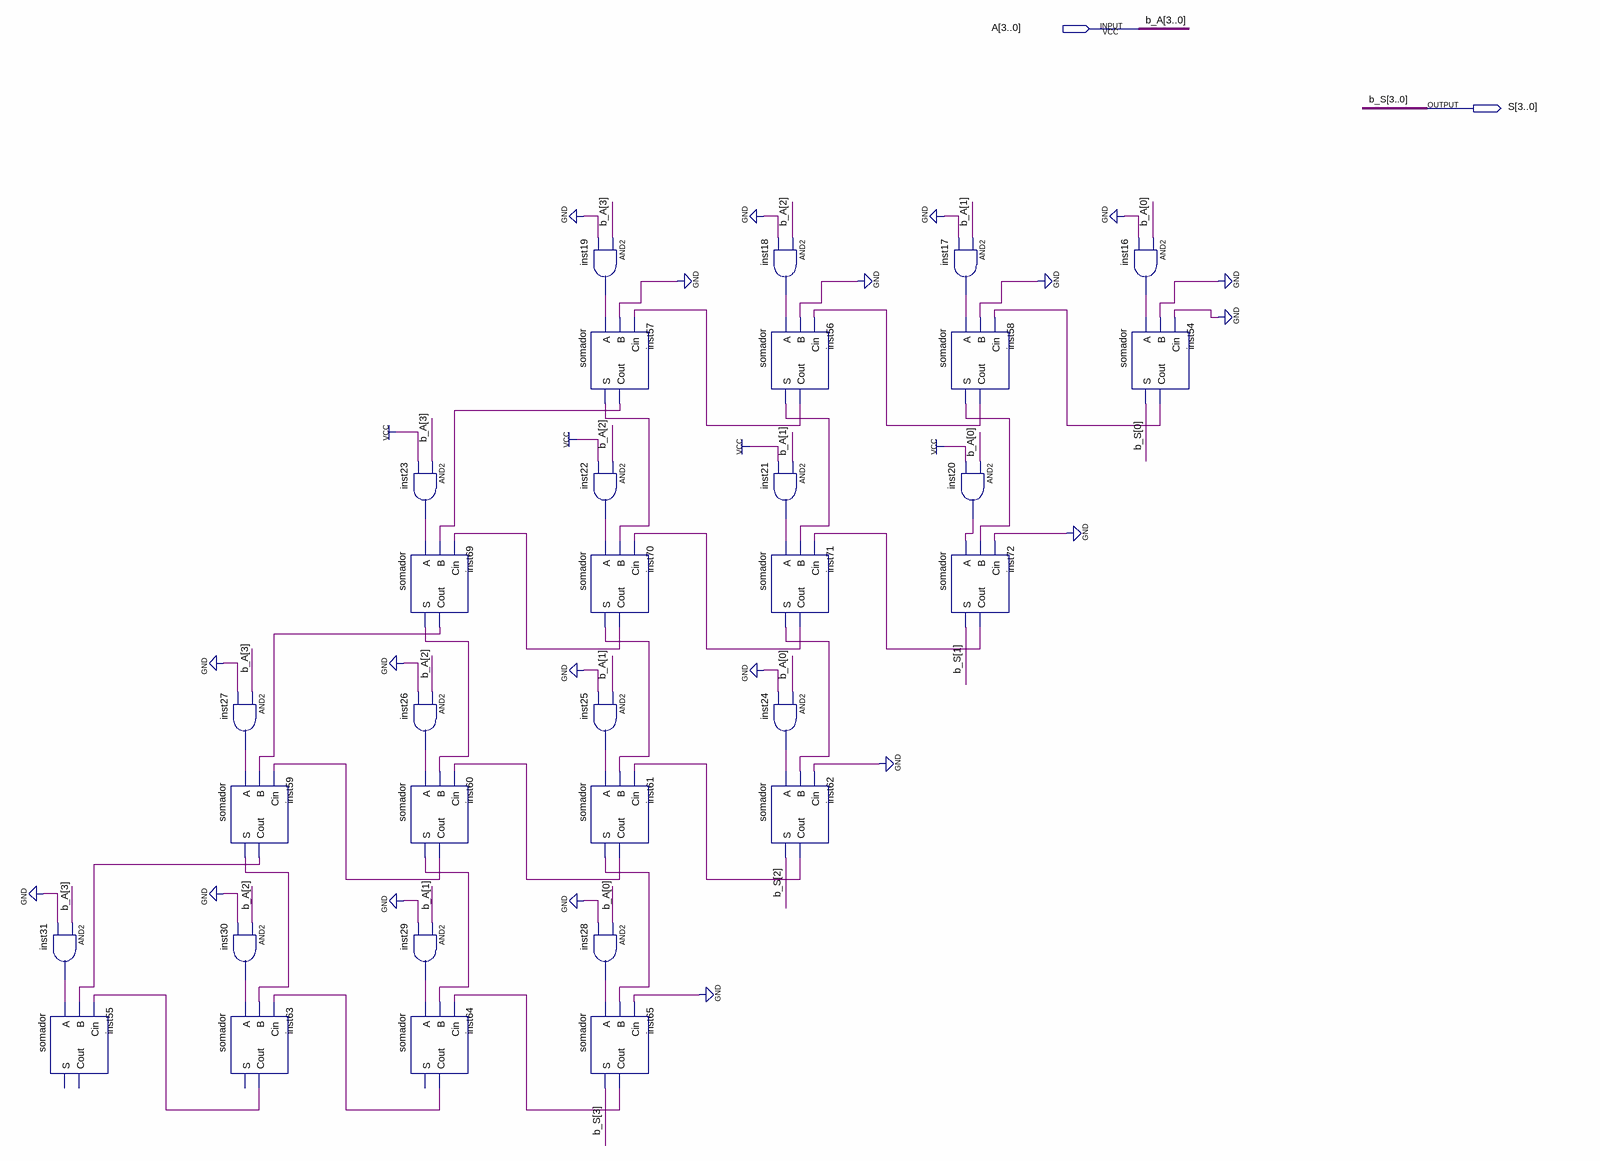
[diagram p0: schematic sheet]
// Quartus schematic multiplicacao.bdf as structural Verilog: 32 symbols, 2 pins
module multiplicacao (
  input  [3:0] A,
  output [3:0] S
);

  wire inst16_out, inst17_out, inst18_out, inst19_out, inst20_out, inst21_out, inst22_out, inst23_out,
       inst24_out, inst25_out, inst26_out, inst27_out, inst28_out, inst29_out, inst30_out, inst31_out,
       inst54_cout, inst56_cout, inst56_s, inst57_cout, inst57_s, inst58_cout, inst58_s, inst59_cout,
       inst59_s, inst60_cout, inst60_s, inst61_cout, inst61_s, inst62_cout, inst63_cout, inst64_cout,
       inst65_cout, inst69_cout, inst69_s, inst70_cout, inst70_s, inst71_cout, inst71_s, inst72_cout;

  and inst31 (inst31_out, A[3], 1'b0);
  somador inst55 (.A(inst31_out), .B(inst59_cout), .Cin(inst63_cout));  // open: S, Cout
  and inst27 (inst27_out, A[3], 1'b0);
  somador inst59 (.A(inst27_out), .B(inst69_cout), .Cin(inst60_cout), .S(inst59_s), .Cout(inst59_cout));
  and inst30 (inst30_out, A[2], 1'b0);
  somador inst63 (.A(inst30_out), .B(inst59_s), .Cin(inst64_cout), .Cout(inst63_cout));  // open: S
  and inst23 (inst23_out, A[3], 1'b1);
  somador inst69 (.A(inst23_out), .B(inst57_cout), .Cin(inst70_cout), .S(inst69_s), .Cout(inst69_cout));
  and inst26 (inst26_out, A[2], 1'b0);
  somador inst60 (.A(inst26_out), .B(inst69_s), .Cin(inst61_cout), .S(inst60_s), .Cout(inst60_cout));
  and inst29 (inst29_out, A[1], 1'b0);
  somador inst64 (.A(inst29_out), .B(inst60_s), .Cin(inst65_cout), .Cout(inst64_cout));  // open: S
  and inst19 (inst19_out, A[3], 1'b0);
  somador inst57 (.A(inst19_out), .B(1'b0), .Cin(inst56_cout), .S(inst57_s), .Cout(inst57_cout));
  and inst22 (inst22_out, A[2], 1'b1);
  somador inst70 (.A(inst22_out), .B(inst57_s), .Cin(inst71_cout), .S(inst70_s), .Cout(inst70_cout));
  and inst25 (inst25_out, A[1], 1'b0);
  somador inst61 (.A(inst25_out), .B(inst70_s), .Cin(inst62_cout), .S(inst61_s), .Cout(inst61_cout));
  and inst28 (inst28_out, A[0], 1'b0);
  somador inst65 (.A(inst28_out), .B(inst61_s), .Cin(1'b0), .S(S[3]), .Cout(inst65_cout));
  and inst18 (inst18_out, A[2], 1'b0);
  somador inst56 (.A(inst18_out), .B(1'b0), .Cin(inst58_cout), .S(inst56_s), .Cout(inst56_cout));
  and inst21 (inst21_out, A[1], 1'b1);
  somador inst71 (.A(inst21_out), .B(inst56_s), .Cin(inst72_cout), .S(inst71_s), .Cout(inst71_cout));
  and inst24 (inst24_out, A[0], 1'b0);
  somador inst62 (.A(inst24_out), .B(inst71_s), .Cin(1'b0), .S(S[2]), .Cout(inst62_cout));
  and inst17 (inst17_out, A[1], 1'b0);
  somador inst58 (.A(inst17_out), .B(1'b0), .Cin(inst54_cout), .S(inst58_s), .Cout(inst58_cout));
  somador inst72 (.A(inst20_out), .B(inst58_s), .Cin(1'b0), .S(S[1]), .Cout(inst72_cout));
  and inst20 (inst20_out, A[0], 1'b1);
  somador inst54 (.A(inst16_out), .B(1'b0), .Cin(1'b0), .S(S[0]), .Cout(inst54_cout));
  and inst16 (inst16_out, A[0], 1'b0);

  // Other names for the same wires on the sheet: b_A[3:0] = A; b_S[3:0] = S
endmodule
